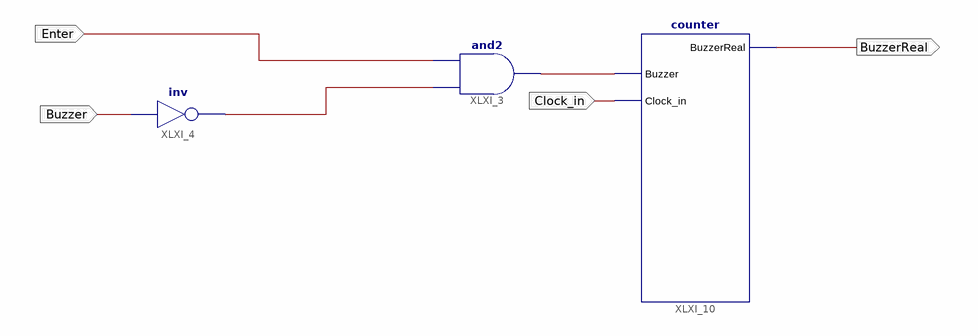
[diagram p0: schematic sheet 1]
// Xilinx ISE schematic buzzer.sch (spartan6) as structural Verilog: 3 symbols, 4 ports
module buzzer (
  input  Buzzer,
  input  Enter,
  input  Clock_in,
  output BuzzerReal
);

  wire XLXN_19, XLXN_21;

  not XLXI_4 (XLXN_19, Buzzer);
  and XLXI_3 (XLXN_21, XLXN_19, Enter);
  counter XLXI_10 (.Buzzer(XLXN_21), .Clock_in(Clock_in), .BuzzerReal(BuzzerReal));
endmodule
